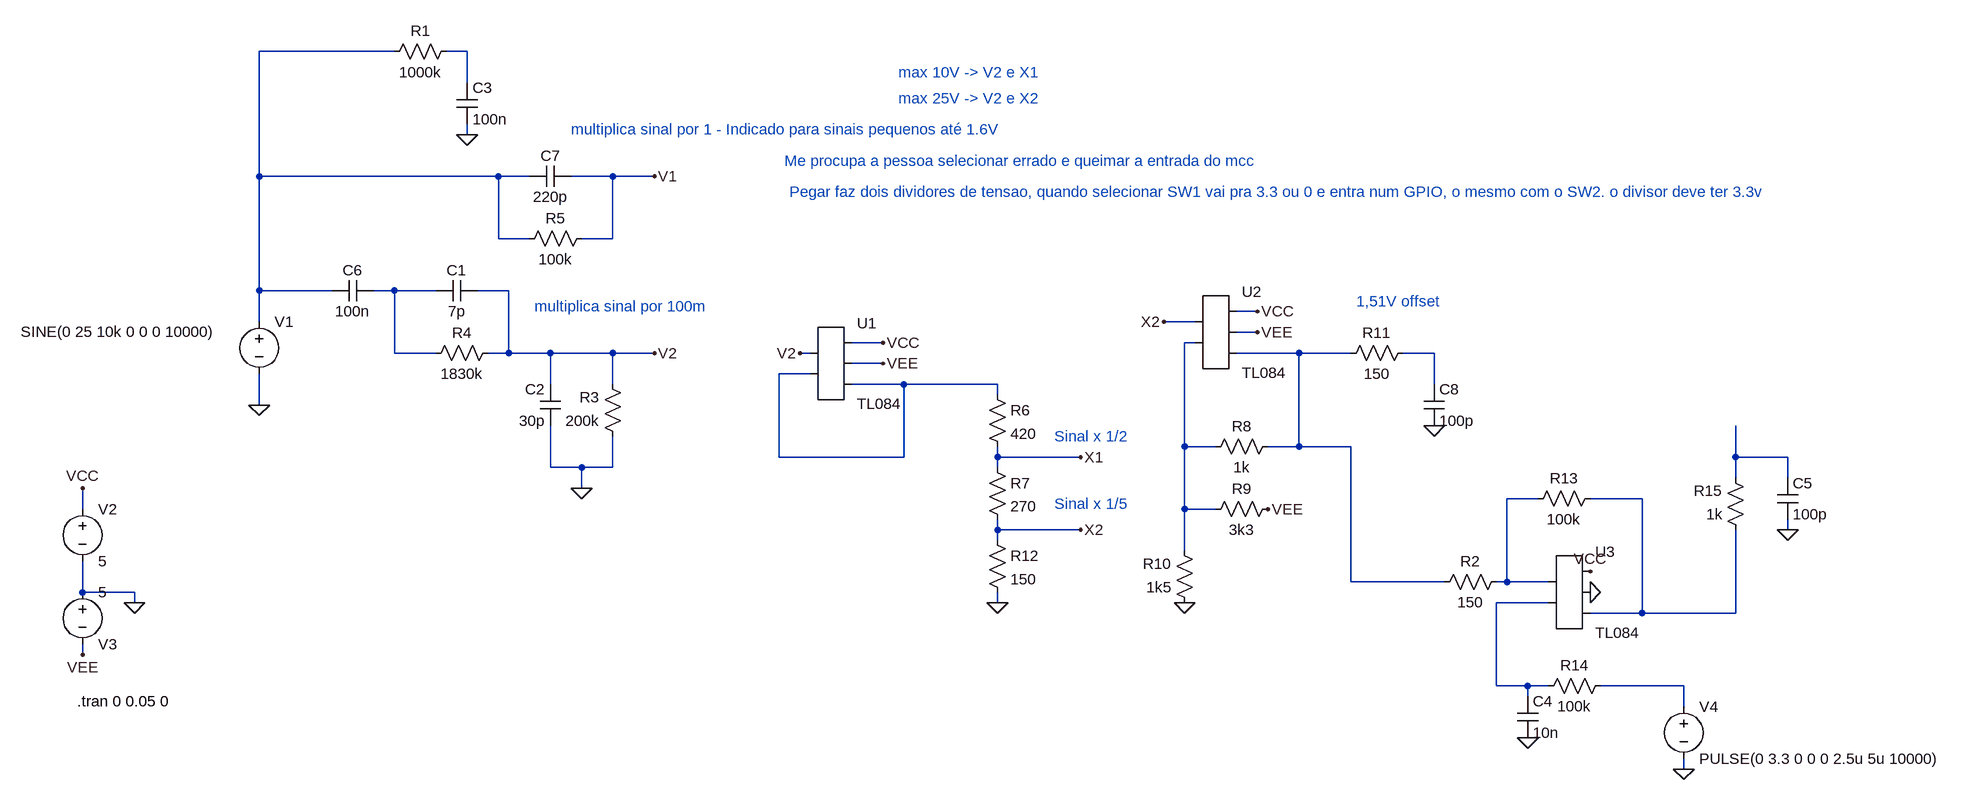
[diagram p0: schematic Draft3.asc]
Draft3.asc, the LTspice schematic file:
Version 4
SHEET 1 2580 852
WIRE 80 -272 -128 -272
WIRE 192 -272 160 -272
WIRE 192 -224 192 -272
WIRE 192 -144 192 -160
WIRE -128 -80 -128 -272
WIRE 240 -80 -128 -80
WIRE 288 -80 240 -80
WIRE 416 -80 352 -80
WIRE 480 -80 416 -80
WIRE 240 16 240 -80
WIRE 288 16 240 16
WIRE 416 16 416 -80
WIRE 416 16 368 16
WIRE -128 96 -128 -80
WIRE -16 96 -128 96
WIRE 80 96 48 96
WIRE 144 96 80 96
WIRE 256 96 208 96
WIRE 1408 128 1376 128
WIRE -128 144 -128 96
WIRE 1312 144 1264 144
WIRE 1408 160 1376 160
WIRE 832 176 784 176
WIRE 1312 176 1296 176
WIRE 80 192 80 96
WIRE 144 192 80 192
WIRE 256 192 256 96
WIRE 256 192 224 192
WIRE 320 192 256 192
WIRE 416 192 320 192
WIRE 480 192 416 192
WIRE 720 192 704 192
WIRE 1472 192 1376 192
WIRE 1552 192 1472 192
WIRE 1680 192 1632 192
WIRE 832 208 784 208
WIRE 720 224 672 224
WIRE 320 240 320 192
WIRE 416 240 416 192
WIRE 864 240 784 240
WIRE 1008 240 864 240
WIRE 1680 240 1680 192
WIRE 1008 256 1008 240
WIRE -128 272 -128 224
WIRE 1296 336 1296 176
WIRE 1344 336 1296 336
WIRE 1472 336 1472 192
WIRE 1472 336 1424 336
WIRE 1552 336 1472 336
WIRE 672 352 672 224
WIRE 864 352 864 240
WIRE 864 352 672 352
WIRE 1008 352 1008 336
WIRE 1136 352 1008 352
WIRE 2144 352 2144 304
WIRE 2224 352 2144 352
WIRE 320 368 320 304
WIRE 368 368 320 368
WIRE 416 368 416 320
WIRE 416 368 368 368
WIRE 1008 368 1008 352
WIRE 2144 384 2144 352
WIRE 2224 384 2224 352
WIRE 368 400 368 368
WIRE 1840 416 1792 416
WIRE 2000 416 1920 416
WIRE -400 432 -400 400
WIRE 1296 432 1296 336
WIRE 1344 432 1296 432
WIRE 1008 464 1008 448
WIRE 1136 464 1008 464
WIRE 2224 464 2224 448
WIRE 1008 480 1008 464
WIRE 1296 496 1296 432
WIRE 1552 544 1552 336
WIRE 1696 544 1552 544
WIRE 1792 544 1792 416
WIRE 1792 544 1776 544
WIRE 1856 544 1792 544
WIRE -400 560 -400 512
WIRE -320 560 -400 560
WIRE -320 576 -320 560
WIRE 1008 576 1008 560
WIRE 1856 576 1776 576
WIRE 2000 592 2000 416
WIRE 2000 592 1920 592
WIRE 2144 592 2144 464
WIRE 2144 592 2000 592
WIRE -400 656 -400 640
WIRE 1776 704 1776 576
WIRE 1824 704 1776 704
WIRE 1856 704 1824 704
WIRE 2064 704 1936 704
WIRE 1824 720 1824 704
WIRE 2064 736 2064 704
WIRE 2064 832 2064 816
FLAG 368 400 0
FLAG 480 192 V2
FLAG -128 272 0
FLAG 480 -80 V1
FLAG -320 576 0
FLAG -400 400 VCC
FLAG 832 176 VCC
FLAG -400 656 VEE
FLAG 832 208 VEE
FLAG 1136 352 X1
FLAG 1136 464 X2
FLAG 1408 128 VCC
FLAG 1408 160 VEE
FLAG 1680 304 0
FLAG 1296 576 0
FLAG 1424 432 VEE
FLAG 1008 576 0
FLAG 1264 144 X2
FLAG 704 192 V2
FLAG 192 -144 0
FLAG 1920 528 VCC
FLAG 1824 784 0
FLAG 2064 832 0
FLAG 1920 560 0
FLAG 2224 464 0
SYMBOL cap 208 80 R90
WINDOW 0 0 32 VBottom 2
WINDOW 3 32 32 VTop 2
SYMATTR InstName C1
SYMATTR Value 7p
SYMBOL cap 336 304 R180
WINDOW 0 24 56 Left 2
WINDOW 3 24 8 Left 2
SYMATTR InstName C2
SYMATTR Value 30p
SYMBOL res 432 336 R180
WINDOW 0 36 76 Left 2
WINDOW 3 36 40 Left 2
SYMATTR InstName R3
SYMATTR Value 200k
SYMBOL res 128 208 R270
WINDOW 0 32 56 VTop 2
WINDOW 3 0 56 VBottom 2
SYMATTR InstName R4
SYMATTR Value 1830k
SYMBOL cap 48 80 R90
WINDOW 0 0 32 VBottom 2
WINDOW 3 32 32 VTop 2
SYMATTR InstName C6
SYMATTR Value 100n
SYMBOL voltage -128 128 R0
WINDOW 3 -367 31 Left 2
WINDOW 123 0 0 Left 0
WINDOW 39 0 0 Left 0
SYMATTR Value SINE(0 25 10k 0 0 0 10000)
SYMATTR InstName V1
SYMBOL cap 352 -96 R90
WINDOW 0 0 32 VBottom 2
WINDOW 3 32 32 VTop 2
SYMATTR InstName C7
SYMATTR Value 220p
SYMBOL res 384 0 R90
WINDOW 0 0 56 VBottom 2
WINDOW 3 32 56 VTop 2
SYMATTR InstName R5
SYMATTR Value 100k
SYMBOL AutoGenerated\\TL084 752 208 R0
SYMATTR InstName U1
SYMBOL voltage -400 416 R0
WINDOW 123 0 0 Left 0
WINDOW 39 0 0 Left 0
SYMATTR InstName V2
SYMATTR Value 5
SYMBOL voltage -400 544 R0
WINDOW 0 24 96 Left 2
WINDOW 3 24 16 Left 2
WINDOW 123 0 0 Left 0
WINDOW 39 0 0 Left 0
SYMATTR InstName V3
SYMATTR Value 5
SYMBOL res 992 240 R0
SYMATTR InstName R6
SYMATTR Value 420
SYMBOL res 992 352 R0
SYMATTR InstName R7
SYMATTR Value 270
SYMBOL AutoGenerated\\TL084 1344 160 R0
SYMATTR InstName U2
SYMBOL res 1440 320 R90
WINDOW 0 0 56 VBottom 2
WINDOW 3 32 56 VTop 2
SYMATTR InstName R8
SYMATTR Value 1k
SYMBOL res 1440 416 R90
WINDOW 0 0 56 VBottom 2
WINDOW 3 32 56 VTop 2
SYMATTR InstName R9
SYMATTR Value 3k3
SYMBOL res 1312 592 R180
WINDOW 0 36 76 Left 2
WINDOW 3 36 40 Left 2
SYMATTR InstName R10
SYMATTR Value 1k5
SYMBOL res 1536 208 R270
WINDOW 0 32 56 VTop 2
WINDOW 3 0 56 VBottom 2
SYMATTR InstName R11
SYMATTR Value 150
SYMBOL cap 1664 240 R0
SYMATTR InstName C8
SYMATTR Value 100p
SYMBOL res 992 464 R0
SYMATTR InstName R12
SYMATTR Value 150
SYMBOL res 176 -288 R90
WINDOW 0 0 56 VBottom 2
WINDOW 3 32 56 VTop 2
SYMATTR InstName R1
SYMATTR Value 1000k
SYMBOL cap 176 -224 R0
SYMATTR InstName C3
SYMATTR Value 100n
SYMBOL AutoGenerated\\TL084 1888 560 R0
SYMATTR InstName U3
SYMBOL res 1792 528 R90
WINDOW 0 0 56 VBottom 2
WINDOW 3 32 56 VTop 2
SYMATTR InstName R2
SYMATTR Value 150
SYMBOL res 1936 400 R90
WINDOW 0 0 56 VBottom 2
WINDOW 3 32 56 VTop 2
SYMATTR InstName R13
SYMATTR Value 100k
SYMBOL res 1952 688 R90
WINDOW 0 0 56 VBottom 2
WINDOW 3 32 56 VTop 2
SYMATTR InstName R14
SYMATTR Value 100k
SYMBOL res 2160 480 R180
WINDOW 0 36 76 Left 2
WINDOW 3 36 40 Left 2
SYMATTR InstName R15
SYMATTR Value 1k
SYMBOL cap 1808 720 R0
SYMATTR InstName C4
SYMATTR Value 10n
SYMBOL voltage 2064 720 R0
WINDOW 123 0 0 Left 0
WINDOW 39 0 0 Left 0
SYMATTR InstName V4
SYMATTR Value PULSE(0 3.3 0 0 0 2.5u 5u 10000)
SYMBOL cap 2208 384 R0
SYMATTR InstName C5
SYMATTR Value 100p
TEXT -408 728 Left 2 !.tran 0 0.05 0
TEXT 352 -152 Left 2 ;multiplica sinal por 1 - Indicado para sinais pequenos até 1.6V
TEXT 296 120 Left 2 ;multiplica sinal por 100m
TEXT 1096 320 Left 2 ;Sinal x 1/2
TEXT 1096 424 Left 2 ;Sinal x 1/5
TEXT 1560 112 Left 2 ;1,51V offset
TEXT 856 -240 Left 2 ;max 10V -> V2 e X1
TEXT 856 -200 Left 2 ;max 25V -> V2 e X2
TEXT 680 -104 Left 2 ;Me procupa a pessoa selecionar errado e queimar a entrada do mcc
TEXT 688 -56 Left 2 ;Pegar faz dois dividores de tensao, quando selecionar SW1 vai pra 3.3 ou 0 e entra num GPIO, o mesmo com o SW2. o divisor deve ter 3.3v

The netlist it stands for:
* Draft3.asc
C1 V2 N003 7p
C2 0 V2 30p
R3 0 V2 200k
R4 N003 V2 1830k
C6 N003 N001 100n
V1 N001 0 SINE(0 25 10k 0 0 0 10000)
C7 V1 N001 220p
R5 V1 N001 100k
* U1: TL084 (symbol AutoGenerated\TL084 not available, pins judged from their places): pin1=V2 pin2=N007 pin3=VCC pin4=VEE pin5=N007
V2 VCC 0 5
V3 0 VEE 5
R6 N007 X1 420
R7 X1 X2 270
* U2: TL084 (symbol AutoGenerated\TL084 not available, pins judged from their places): pin1=X2 pin2=N004 pin3=VCC pin4=VEE pin5=N005
R8 N005 N004 1k
R9 VEE N004 3k3
R10 0 N004 1k5
R11 N005 N006 150
C8 N006 0 100p
R12 X2 0 150
R1 N002 N001 1000k
C3 N002 0 100n
* U3: TL084 (symbol AutoGenerated\TL084 not available, pins judged from their places): pin1=N009 pin2=N011 pin3=VCC pin4=0 pin5=N010
R2 N009 N005 150
R13 N010 N009 100k
R14 N012 N011 100k
R15 N010 N008 1k
C4 N011 0 10n
V4 N012 0 PULSE(0 3.3 0 0 0 2.5u 5u 10000)
C5 N008 0 100p
.tran 0 0.05 0
* multiplica sinal por 1 - Indicado para sinais pequenos até 1.6V
* multiplica sinal por 100m
* Sinal x 1/2
* Sinal x 1/5
* 1,51V offset
* max 10V -> V2 e X1
* max 25V -> V2 e X2
* Me procupa a pessoa selecionar errado e queimar a entrada do mcc
* Pegar faz dois dividores de tensao, quando selecionar SW1 vai pra 3.3 ou 0 e entra num GPIO, o mesmo com o SW2. o divisor deve ter 3.3v
.backanno
.end